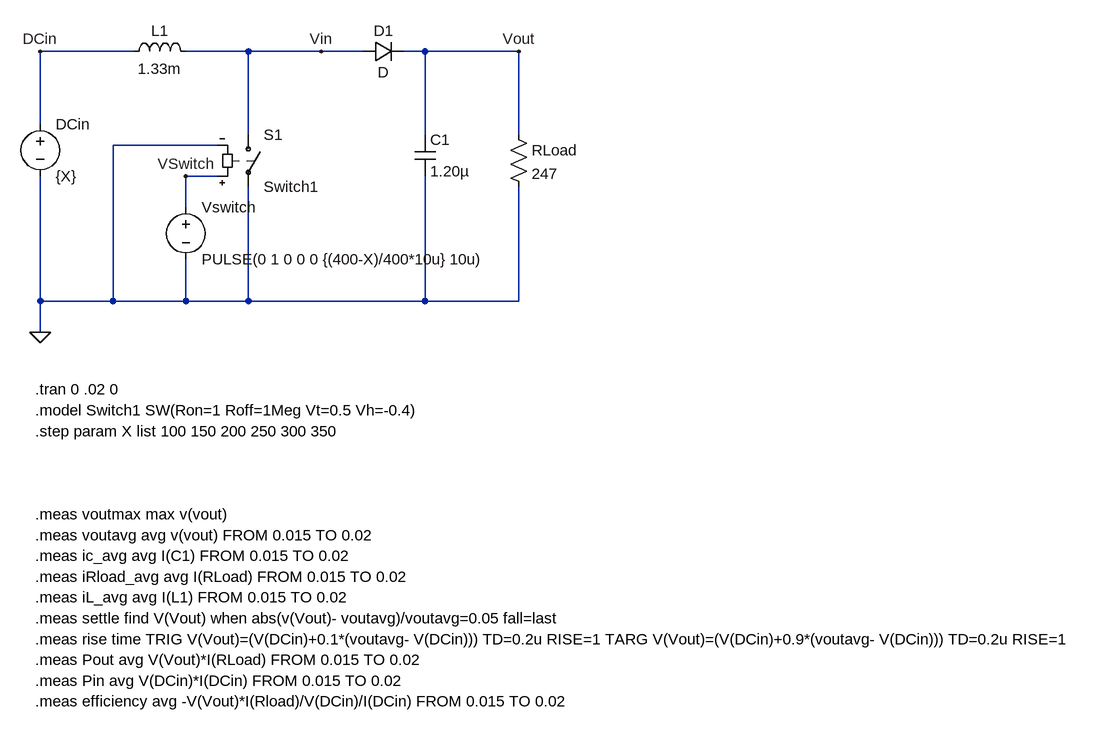
[diagram p0: schematic Boost SMPS Vary Vin.asc]
Boost SMPS Vary Vin.asc, the LTspice schematic file:
Version 4
SHEET 1 2928 1120
WIRE 192 16 48 16
WIRE 368 16 272 16
WIRE 480 16 368 16
WIRE 544 16 480 16
WIRE 640 16 608 16
WIRE 784 16 640 16
WIRE 48 128 48 16
WIRE 368 144 368 16
WIRE 640 144 640 16
WIRE 784 144 784 16
WIRE 320 160 160 160
WIRE 320 208 272 208
WIRE 272 256 272 208
WIRE 48 400 48 208
WIRE 160 400 160 160
WIRE 160 400 48 400
WIRE 272 400 272 336
WIRE 272 400 160 400
WIRE 368 400 368 224
WIRE 368 400 272 400
WIRE 640 400 640 208
WIRE 640 400 368 400
WIRE 784 400 784 224
WIRE 784 400 640 400
WIRE 48 448 48 400
FLAG 784 16 Vout
FLAG 48 448 0
FLAG 480 16 Vin
FLAG 272 208 VSwitch
FLAG 48 16 DCin
SYMBOL voltage 48 112 R0
WINDOW 123 0 0 Left 0
WINDOW 39 0 0 Left 0
SYMATTR InstName DCin
SYMATTR Value {X}
SYMBOL ind 176 32 R270
WINDOW 0 32 56 VTop 2
WINDOW 3 5 56 VBottom 2
SYMATTR InstName L1
SYMATTR Value 1.33m
SYMBOL diode 544 32 R270
WINDOW 0 32 32 VTop 2
WINDOW 3 0 32 VBottom 2
SYMATTR InstName D1
SYMBOL cap 624 144 R0
SYMATTR InstName C1
SYMATTR Value 1.20µ
SYMBOL res 768 128 R0
SYMATTR InstName RLoad
SYMATTR Value 247
SYMBOL sw 368 128 R0
SYMATTR InstName S1
SYMATTR Value Switch1
SYMBOL voltage 272 240 R0
WINDOW 123 0 0 Left 0
WINDOW 39 0 0 Left 0
SYMATTR InstName Vswitch
SYMATTR Value PULSE(0 1 0 0 0 {(400-X)/400*10u} 10u)
TEXT 40 536 Left 2 !.tran 0 .02 0
TEXT 40 568 Left 2 !.model Switch1 SW(Ron=1 Roff=1Meg Vt=0.5 Vh=-0.4)
TEXT 40 728 Left 2 !.meas voutmax max v(vout)
TEXT 40 760 Left 2 !.meas voutavg avg v(vout) FROM 0.015 TO 0.02
TEXT 40 600 Left 2 !.step param X list 100 150 200 250 300 350
TEXT 40 792 Left 2 !.meas ic_avg avg I(C1) FROM 0.015 TO 0.02
TEXT 40 824 Left 2 !.meas iRload_avg avg I(RLoad) FROM 0.015 TO 0.02
TEXT 40 856 Left 2 !.meas iL_avg avg I(L1) FROM 0.015 TO 0.02
TEXT 40 888 Left 2 !.meas settle find V(Vout) when abs(v(Vout)- voutavg)/voutavg=0.05 fall=last
TEXT 40 920 Left 2 !.meas rise time TRIG V(Vout)=(V(DCin)+0.1*(voutavg- V(DCin))) TD=0.2u RISE=1 TARG V(Vout)=(V(DCin)+0.9*(voutavg- V(DCin))) TD=0.2u RISE=1
TEXT 40 952 Left 2 !.meas Pout avg V(Vout)*I(RLoad) FROM 0.015 TO 0.02
TEXT 40 984 Left 2 !.meas Pin avg V(DCin)*I(DCin) FROM 0.015 TO 0.02
TEXT 40 1016 Left 2 !.meas efficiency avg -V(Vout)*I(Rload)/V(DCin)/I(DCin) FROM 0.015 TO 0.02

The netlist it stands for:
* Boost SMPS Vary Vin.asc
V§DCin DCin 0 {X}
L1 DCin Vin 1.33m
D1 Vin Vout D
C1 Vout 0 1.20µ
RLoad Vout 0 247
S1 Vin 0 VSwitch 0 Switch1
Vswitch VSwitch 0 PULSE(0 1 0 0 0 {(400-X)/400*10u} 10u)
.model D D
.lib standard.dio
.tran 0 .02 0
.model Switch1 SW(Ron=1 Roff=1Meg Vt=0.5 Vh=-0.4)
.meas voutmax max v(vout)
.meas voutavg avg v(vout) FROM 0.015 TO 0.02
.step param X list 100 150 200 250 300 350
.meas ic_avg avg I(C1) FROM 0.015 TO 0.02
.meas iRload_avg avg I(RLoad) FROM 0.015 TO 0.02
.meas iL_avg avg I(L1) FROM 0.015 TO 0.02
.meas settle find V(Vout) when abs(v(Vout)- voutavg)/voutavg=0.05 fall=last
.meas rise time TRIG V(Vout)=(V(DCin)+0.1*(voutavg- V(DCin))) TD=0.2u RISE=1 TARG V(Vout)=(V(DCin)+0.9*(voutavg- V(DCin))) TD=0.2u RISE=1
.meas Pout avg V(Vout)*I(RLoad) FROM 0.015 TO 0.02
.meas Pin avg V(DCin)*I(DCin) FROM 0.015 TO 0.02
.meas efficiency avg -V(Vout)*I(Rload)/V(DCin)/I(DCin) FROM 0.015 TO 0.02
.backanno
.end